# EAGLE design transmitter (EAGLE 8.4.1)
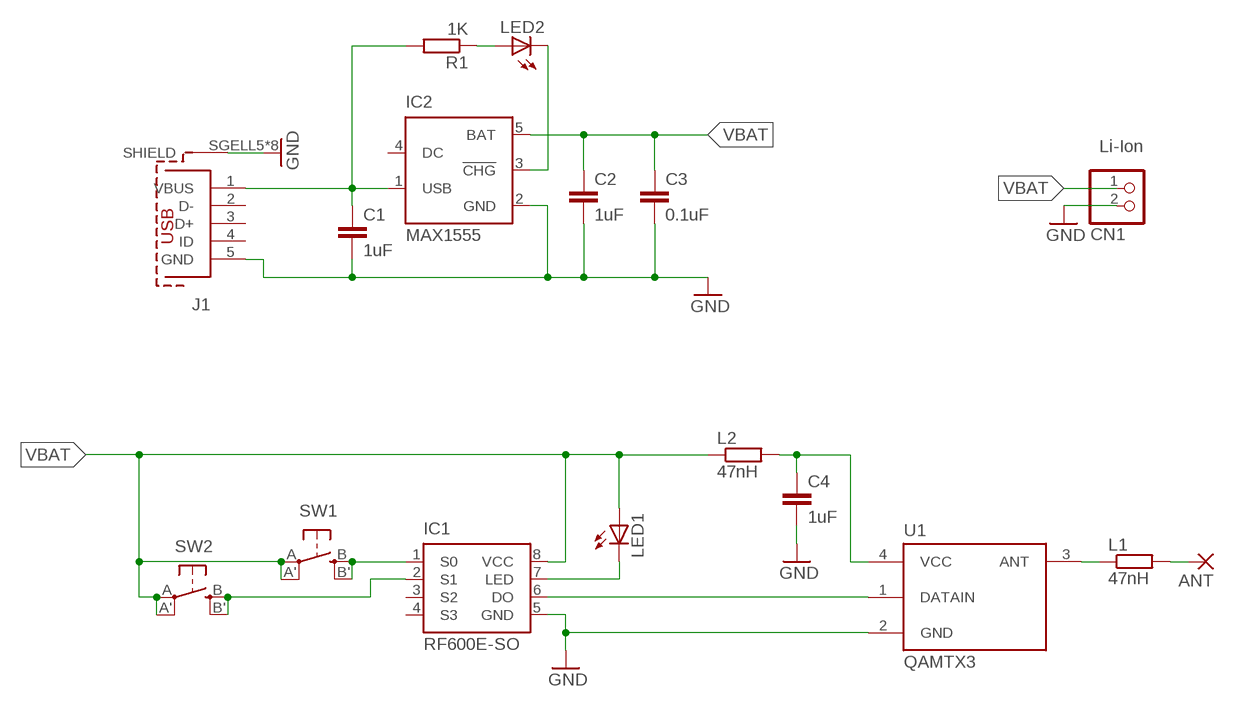
[diagram p0: schematic, sheet 1]

## Parts
ANT  SMD2  [SMD1,27-2,54]
C1  1uF  C-EUC0603K  [C0603K]
C2  1uF  C-EUC0603K  [C0603K]
C3  0.1uF  C-EUC0603K  [C0603K]
C4  1uF  C-EUC0603K  [C0603K]
CN1  JST_2PIN-SMT-RA  [JST-PH-2-SMT-RA]
IC1  RF600E-SO  [SO-08]
IC2  MAX1555  [SOT23-5L]
J1  629105150921  [629105150921]
L1  47nH  R-EU_R0603  [R0603]
L2  47nH  R-EU_R0603  [R0603]
LED1  LEDCHIP-LED0805  [CHIP-LED0805]
LED2  LEDCHIP-LED0805  [CHIP-LED0805]
R1  1K  R-EU_R0603  [R0603]
SW1  SPST_TACT-EVQQ2  [EVQ-Q2]
SW2  SPST_TACT-EVQQ2  [EVQ-Q2]
U1  QAMTX3  [QAM-TX3]

## Nets
ANT: L1.1 U1.3(ANT)
DATAIN: IC1.6(DO) U1.1(DATAIN)
GND: C1.2 C2.2 C3.2 C4.2 CN1.2 IC1.5(GND) IC2.2(GND) J1.5(GND) J1.SGELL5(SHIELD) J1.SHELL1(SHIELD) J1.SHELL2(SHIELD) J1.SHELL3(SHIELD) J1.SHELL4(SHIELD) J1.SHELL6(SHIELD) J1.SHELL7(SHIELD) J1.SHELL(SHIELD) U1.2(GND)
N$1: IC1.1(S0) SW1.B'(S1) SW1.B(S)
N$2: IC1.2(S1) SW2.B'(S1) SW2.B(S)
N$3: C4.1 L2.2 U1.4(VCC)
N$5: IC2.3(!CHG) LED2.C
N$6: IC1.7(LED) LED1.C
N$7: LED2.A R1.1
N$9: ANT.1(P) L1.2
VBAT: C2.1 C3.1 CN1.1 IC1.8(VCC) IC2.5(BAT) L2.1 LED1.A SW1.A'(P1) SW1.A(P) SW2.A'(P1) SW2.A(P)
VUSB: C1.1 IC2.1(USB) J1.1(VBUS) R1.2
Unconnected: IC1.3(S2) IC1.4(S3) IC2.4(DC) J1.2(D-) J1.3(D+) J1.4(ID)

## Notes on the sheet
- Li-Ion

## Library data of the parts
ANT = wirepad:SMD2: SMD PAD
C1-C4 = rcl:C-EU: CAPACITOR, European symbol
CN1 = adafruit:JST_2PIN: JST 2-Pin Connectors of various flavors SMT-RA (S2B-PH-SM4) 4UConnector #17311 SMT (B2B-PH-SM4) THM-RA (S2B-PH) THM (B2B-PH)
IC1 = rf-solutions:RF600E: RF / IR Encoder Source: RF600D.pdf; MF: FARNELL; MPN: RF600E-SO; OC_FARNELL: 8733805; OC_NEWARK: 18K6847
IC2 = maxim:MAX1555: Dual-Input USB/AC Adapter 1-Cell Li+ Battery Chargers Source: http://www.maxim-ic.com .. MAX1551-MAX1555.pdf; MF: MAXIM; MPN: MAX1555EZK+T; OC_FARNELL: 1628222; OC_NEWARK: 59J2761
J1 = InputOutputIO (rev17d):629105150921: WR-COM_USB_Micro Type AB_Horizontal_SMT ; Micro Type AB Horizontal SMT - with Pegs - T&R Packaging Code : Con_I-O_COM_USB_2.0_AB_629105150921_629105150921 <http://katalog.we-online.de/media/images/eican/Con_I-O_COM_USB_2.0_AB_629105150921_pf2.jpg> Details see: http://katalog.we-online.de/em/datasheet/629105150921.pdf Created 12/08/2014, Dan Xu 2014 (C) Wurth Elektronik
L1 L2 R1 = rcl:R-EU_: RESISTOR, European symbol
LED1 LED2 = led:LED: LED OSRAM: - CHIPLED LG R971, LG N971, LY N971, LG Q971, LY Q971, LO R971, LY R971 LH N974, LH R974 LS Q976, LO Q976, LY Q976 LO Q996 - Hyper CHIPLED LW Q18S LB Q993, LB Q99A, LB R99A - SideLED LS A670, LO A670, LY A670, LG A670, LP A670 LB A673, LV A673, LT A673, LW A673 LH A674 LY A675 LS A676, LA A676, LO A676, LY A676, LW A676 LS A679, LY A679, LG A679 - Hyper Micro SIDELED® LS Y876, LA Y876, LO Y876, LY Y876 LT Y87S - SmartLED LW L88C, LW L88S LB L89C, LB L89S, LG L890 LS L89K, LO L89K, LY L89K LS L896, LA L896, LO L896, LY L896 - TOPLED LS T670, LO T670, LY T670, LG T670, LP T670 LSG T670, LSP T670, LSY T670, LOP T670, LYG T670 LG T671, LOG T671, LSG T671 LB T673, LV T673, LT T673, LW T673 LH T674 LS T676, LA T676, LO T676, LY T676, LB T676, LH T676, LSB T676, LW T676 LB T67C, LV T67C, LT T67C, LS T67K, LO T67K, LY T67K, LW E67C LS E67B, LA E67B, LO E67B, LY E67B, LB E67C, LV E67C, LT E67C LW T67C LS T679, LY T679, LG T679 LS T770, LO T770, LY T770, LG T770, LP T770 LB T773, LV T773, LT T773, LW T773 LH T774 LS E675, LA E675, LY E675, LS T675 LS T776, LA T776, LO T776, LY T776, LB T776 LHGB T686 LT T68C, LB T68C - Hyper Mini TOPLED® LB M676 - Mini TOPLED Santana® LG M470 LS M47K, LO M47K, LY M47K Source: http://www.osram.convergy.de LUXEON: - LUMILED® LXK2-PW12-R00, LXK2-PW12-S00, LXK2-PW14-U00, LXK2-PW14-V00 LXK2-PM12-R00, LXK2-PM12-S00, LXK2-PM14-U00 LXK2-PE12-Q00, LXK2-PE12-R00, LXK2-PE12-S00, LXK2-PE14-T00, LXK2-PE14-U00 LXK2-PB12-K00, LXK2-PB12-L00, LXK2-PB12-M00, LXK2-PB14-N00, LXK2-PB14-P00, LXK2-PB14-Q00 LXK2-PR12-L00, LXK2-PR12-M00, LXK2-PR14-Q00, LXK2-PR14-R00 LXK2-PD12-Q00, LXK2-PD12-R00, LXK2-PD12-S00 LXK2-PH12-R00, LXK2-PH12-S00 LXK2-PL12-P00, LXK2-PL12-Q00, LXK2-PL12-R00 Source: www.luxeon.com KINGBRIGHT: KA-3528ASYC Source: www.kingbright.com
SW1 SW2 = adafruit:SPST_TACT: SMT 6mm switch, EVQQ2 series http://www.ladyada.net/library/eagle
U1 = Protospace:QAMTX3: QAM-TX3 datasheet http://www.farnell.com/datasheets/54127.pdf

## Board
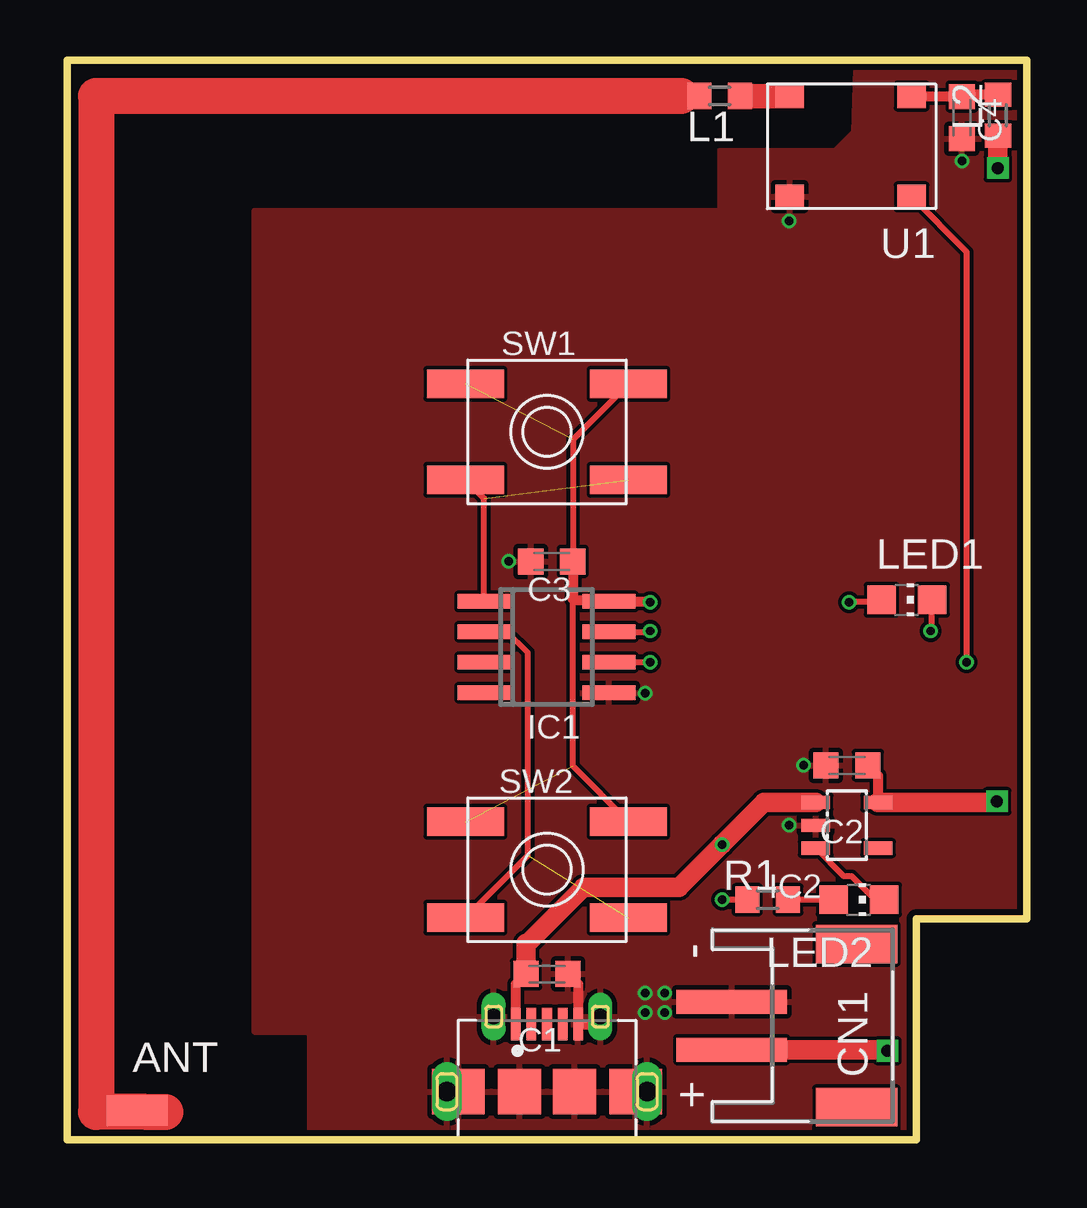
[diagram p1: board, top side]
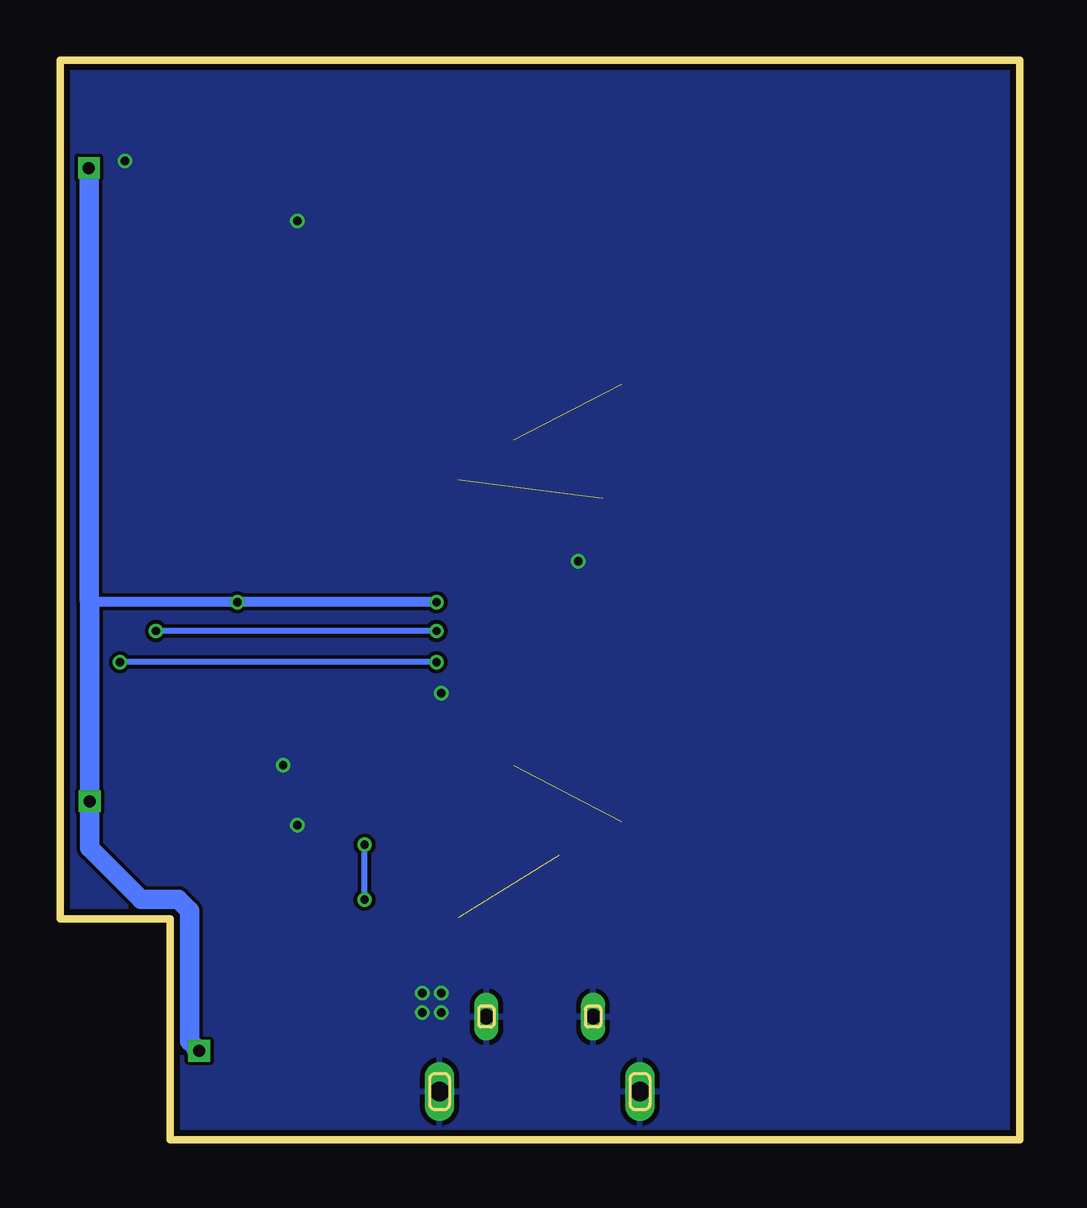
[diagram p2: board, bottom side, seen from below]

Size 40 x 45 mm. Coordinates in mm from the lower left corner, seen from the top.
Outline: 0,0 0,45 40,45 40,9.2 35.4,9.2 35.4,0 0,0
Copper layers (1*16): Top 0.018mm / dielectric 1.55mm / Bottom 0.018mm
Design rules "eC_2Layer_PClass6_BaseCopperO18_eCDefault *": minimum track width 0.15mm, minimum drill 0.35mm, track to track 0.15mm, track to pad 0.25mm, pad to pad 0.15mm, via to via 0.15mm, smd to smd 0mil, copper to edge 0.25mm, drill to drill 0.35mm, minimum pad ring 0.175mm, minimum via ring 0.125mm, stop-mask expansion 0mil, vias tented up to drill 0.45mm, thermal gap 0.2mm

### Footprints (pad centres in the part's own frame; a part is rotated, then mirrored left to right if it is on the bottom)
SMD1,27-2,54 = smd 1.27 x 2.54: 1 0,0
C0603K = smd 1.05 x 1.08: 1 -0.875,0; 2 0.875,0
JST-PH-2-SMT-RA = smd 1 x 4.6: 1 1,-3.7; 2 -1,-3.7 | smd 1.6 x 3.4: NC1 -3.4,1.5; NC2 3.4,1.5
SO-08 = smd 0.6 x 2.2: 1 -1.905,-2.6; 2 -0.635,-2.6; 3 0.635,-2.6; 4 1.905,-2.6; 5 1.905,2.6; 6 0.635,2.6; 7 -0.635,2.6; 8 -1.905,2.6
SOT23-5L = smd 0.55 x 1.2: 1 -0.95,-1.3; 2 0,-1.3; 3 0.95,-1.3; 4 0.95,1.3; 5 -0.95,1.3
629105150921 = smd 0.4 x 1.35: 1 -1.3,2.805; 2 -0.65,2.805; 3 0,2.805; 4 0.65,2.805; 5 1.3,2.805 | smd 1.8 x 1.9: SGELL5 1.15,0; SHELL4 -1.15,0 | drill 0.65 pad 1 long: SHELL -2.225,3.12; SHELL1 2.225,3.12 | smd 2.185 x 1.9: SHELL2 -3.692,0; SHELL6 3.692,0 | drill 0.825 pad 1.05 long: SHELL3 -4.175,0; SHELL7 4.175,0
R0603 = smd 1 x 1.1: 1 -0.85,0; 2 0.85,0
CHIP-LED0805 = smd 1.2 x 1.2: A 0,-1.05; C 0,1.05
EVQ-Q2 = smd 3.2 x 1.2: A -3.4,-2; A' 3.4,-2; B -3.4,2; B' 3.4,2
QAM-TX3 = smd 1.2 x 1: 1 1,4.7; 2 6.08,4.7; 3 6.08,0.5; 4 1,0.5

### Placement (x,y rotation side)
ANT  2.92,1.2 270 top
C1  20,6.9 0 top
C2  32.5,15.6 180 top
C3  20.2,24.1 180 top
C4  37.3,42.6 270 top
CN1  31.4,4.75 270 top
IC1  19.98,20.53 270 top
IC2  32.5,13.1 270 top
J1  20,2 0 top
L1  27.2,43.5 180 top
L2  38.8,42.7 90 top
LED1  35,22.5 270 top
LED2  33,10 270 top
R1  29.2,10 180 top
SW1  20,29.5 180 top
SW2  20,11.25 180 top
U1  36.2,44 180 top

### Tracks (layer width: path | path; a pad name or v marks a point on that pad's centre or on a via)
ANT
  Top 1.016: L1.1 U1.3
DATAIN  (via drill 0.35)
  Top 0.254: IC1.6 v24.3,19.9 | v37.5,19.9 37.5,37 U1.1
  Bottom 0.254: v24.3,19.9 v37.5,19.9
GND  (via drill 0.35)
  Top 0.406: C1.2 21.3,6.47 J1.5 21.91,4.8 J1.SHELL1
  other vias: 30.1,38.3 37.3,40.8 18.4,24.1 24.1,18.6 30.7,15.6 30.1,13.1 24.9,5.3 24.1,5.3 24.9,6.1 24.1,6.1
  pour Top: 32.8,42 32,41.2 27.2,41.2 27.2,38.7 7.8,38.7 7.8,4.5 10.1,4.5 10.1,-1.4 42.3,-1.4 42.3,46.3 32.8,46.3 32.9,45.3
  pour Bottom: -1.1,45.6 41,45.6 41,-1.1 -1.3,-1.1 -1.3,45.2
N$1  (1 unrouted)
  Top 0.254: IC1.1 17.38,26.72 SW1.B'
N$2  (1 unrouted)
  Top 0.254: SW2.B' 19.2,11.85 19.2,20.3 18.34,21.16 IC1.2
N$3
  Top 0.406: L2.2 37.38,43.55 C4.1 35.23,43.48 U1.4
N$5
  Top 0.254: IC2.3 32.37,10.98 32.71,10.98 33.68,10 LED2.C
N$6  (via drill 0.35)
  Top 0.254: IC1.7 24.16,21.16 24.2,21.2 v24.3,21.2 | v36,21.2 36.05,21.25 LED1.C
  Bottom 0.254: v24.3,21.2 v36,21.2
N$7
  Top 0.254: LED2.A R1.1
N$9
  Top 0.254: ANT.1 2.92,1.15 3.3,1.15
  Top 0.406: L1.2 25.6,43.5
  Top 1.5: 25.6,43.5 1.2,43.5 1.2,1.15 3.3,1.15 4.1,1.15
VBAT  (via drill 0.35, 0.5 pad 0.9)  (2 unrouted)
  Top 0.254: 22.52,22.5 IC1.8 | SW2.A 21.07,15.57 21.07,22.52 | SW1.A 21.07,29.18 C3.1 | LED1.A 33.85,22.4 v32.6,22.4 | v34.2,3.7 34.2,3.75 34.19,3.75
  Top 0.305: 23.25,31.5 SW1.A
  Top 0.406: C3.1 21.07,22.52 21.1,22.5 22.52,22.5 | IC2.5 33.8,15.18 C2.1 | IC1.8 24.16,22.43 24.2,22.4 v24.3,22.4
  Top 0.813: 34.19,3.75 CN1.1 | v38.8,40.5 L2.1 | IC2.5 38.76,14.05 v38.76,14.1
  Bottom 0.406: v24.3,22.4 v32.6,22.4 38.69,22.4 38.79,22.5
  Bottom 0.813: 34.3,3.7 v34.2,3.7 34.59,4.09 34.59,9.54 35.06,10.01 36.61,10.01 38.76,12.16 v38.76,14.1 38.76,22.5 38.79,22.5 38.79,40.4 v38.8,40.5
VUSB  (via drill 0.35)
  Top 0.254: R1.2 v27.3,10
  Top 0.406: 31.12,13.97 IC2.1 | J1.1 18.7,6.47 C1.1
  Top 0.813: C1.1 19.12,8.18 19.2,8.18 21.53,10.51 25.51,10.51 v27.3,12.3 29.05,14.05 IC2.1
  Bottom 0.254: v27.3,10 v27.3,12.3